# EAGLE schematic RX (EAGLE 9.2.2)

## Sheet 1 of 3: OPA354-LM7171
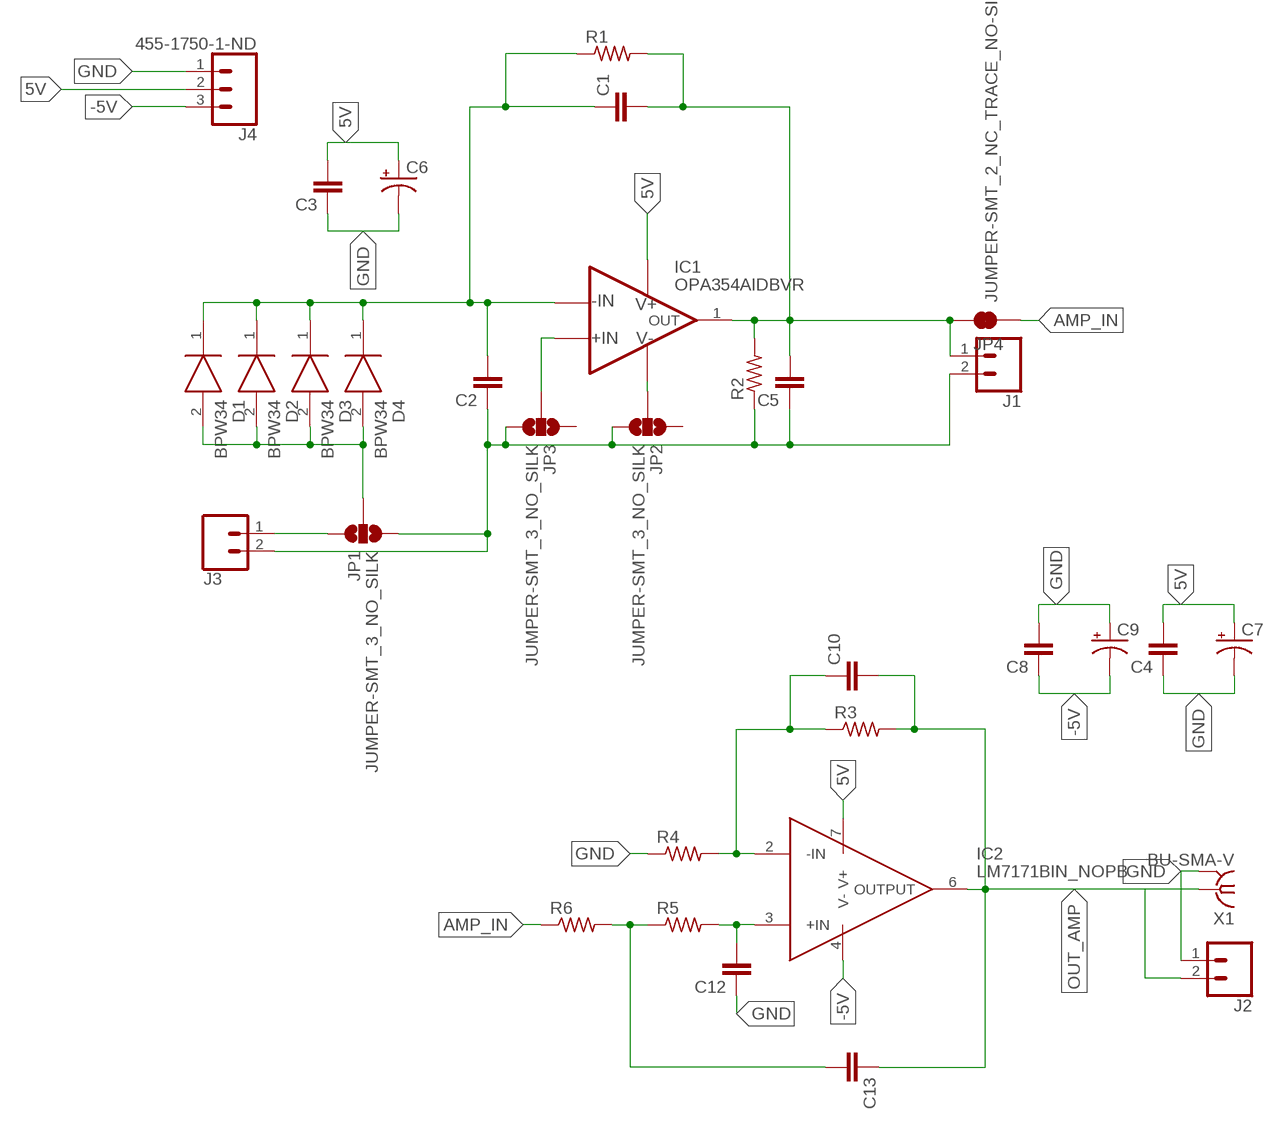
[diagram p0: schematic, sheet 1]

### Parts
C1  C-EUC0603K  [C0603K]
C2  C-EUC0603K  [C0603K]
C3  C-EUC0603K  [C0603K]
C4  C-EUC0603K  [C0603K]
C5  C-EUC0603K  [C0603K]
C6  CPOL-USR/2012-12R  [R/2012-12R]
C7  CPOL-USR/2012-12R  [R/2012-12R]
C8  C-EUC0603K  [C0603K]
C9  CPOL-USR/2012-12R  [R/2012-12R]
C10  C-EUC0603K  [C0603K]
C12  C-EUC0603K  [C0603K]
C13  C-EUC0603K  [C0603K]
D1  BPW34  [BPW34]
D2  BPW34  [BPW34]
D3  BPW34  [BPW34]
D4  BPW34  [BPW34]
IC1  OPA354AIDBVR  [SOT95P280X145-5N@1]
IC2  LM7171BIN_NOPB  [DIP794W53P254L959H508Q8N]
J1  CONN_02  [1X02]
J2  CONN_02  [1X02]
J3  CONN_02  [1X02]
J4  455-1750-1-ND  CONN_03  [1X03]
JP1  JUMPER-SMT_3_NO_SILK  [SMT-JUMPER_3_NO_SILK]
JP2  JUMPER-SMT_3_NO_SILK  [SMT-JUMPER_3_NO_SILK]
JP3  JUMPER-SMT_3_NO_SILK  [SMT-JUMPER_3_NO_SILK]
JP4  JUMPER-SMT_2_NC_TRACE_NO-SILK  [SMT-JUMPER_2_NC_TRACE_NO-SILK]
R1  R-US_R0805  [R0805]
R2  R-US_R0805  [R0805]
R3  R-US_R0805  [R0805]
R4  R-US_R0805  [R0805]
R5  R-US_R0805  [R0805]
R6  R-US_R0805  [R0805]
X1  BU-SMA-V  [BU-SMA-V]

### Nets
5V: C3.2 C4.2 C6.+ C7.+ IC1.5(V+) IC2.7(V+) J4.2
-5V: C8.1 C9.- IC2.4(V-) J4.3
-IN: C1.1 C2.2 D1.1(A) D2.1(A) D3.1(A) D4.1(A) IC1.4(-IN) R1.1
AMP_IN: JP4.1 R6.1
BIAS_PD: D1.2(C) D2.2(C) D3.2(C) D4.2(C) JP1.2
GND: C2.1 C3.1 C4.1 C5.1 C6.- C7.- C8.2 C9.+ C12.1 J1.2 J2.1 J3.2 J4.1 JP1.3 JP2.3 JP3.3 R2.1 R4.1 X1.2 X1.3 X1.4 X1.5
N$1: IC1.3(+IN) JP3.2
N$3: C1.2 C5.2 IC1.1(OUT) J1.1 JP4.2 R1.2 R2.2
N$4: J3.1 JP1.1
N$5: IC1.2(V-) JP2.2
N$6: C10.1 IC2.2(-IN) R3.1 R4.2
N$7: C12.2 IC2.3(+IN) R5.2
N$8: C13.2 R5.1 R6.2
OUT_AMP: C10.2 C13.1 IC2.6(OUTPUT) J2.2 R3.2 X1.1
Unconnected: IC2.1(N/C_1) IC2.5(N/C_2) IC2.8(N/C_3) JP2.1 JP3.1

## Sheet 2 of 3: LTC6265
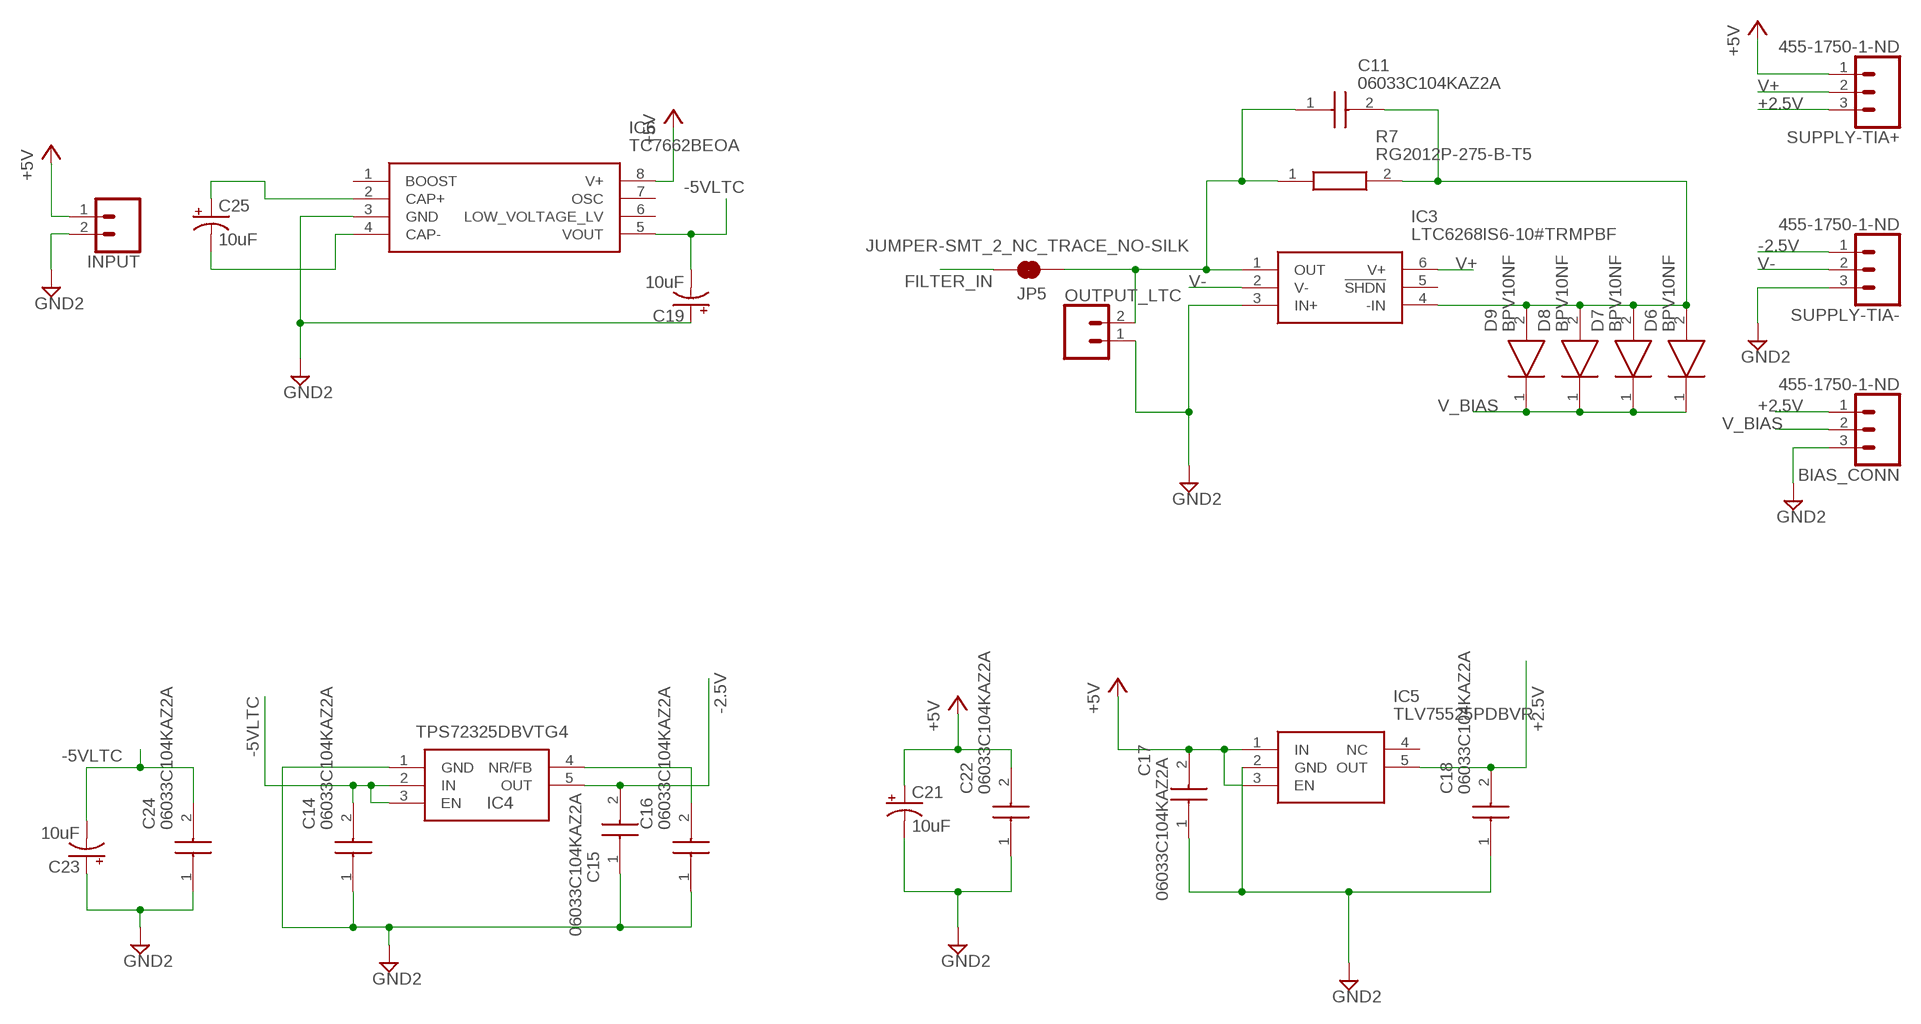
[diagram p1: schematic, sheet 2]

### Parts
BIAS_CONN  455-1750-1-ND  CONN_03  [1X03]
C11  06033C104KAZ2A  [CAPC1608X90N]
C14  06033C104KAZ2A  [CAPC1608X90N]
C15  06033C104KAZ2A  [CAPC1608X90N]
C16  06033C104KAZ2A  [CAPC1608X90N]
C17  06033C104KAZ2A  [CAPC1608X90N]
C18  06033C104KAZ2A  [CAPC1608X90N]
C19  10uF  10UF-POLAR-0603-6.3V-20%(TANT)  [0603-POLAR]
C21  10uF  10UF-POLAR-0603-6.3V-20%(TANT)  [0603-POLAR]
C22  06033C104KAZ2A  [CAPC1608X90N]
C23  10uF  10UF-POLAR-0603-6.3V-20%(TANT)  [0603-POLAR]
C24  06033C104KAZ2A  [CAPC1608X90N]
C25  10uF  10UF-POLAR-0603-6.3V-20%(TANT)  [0603-POLAR]
D6  BPV10NF  [BPV10NF]
D7  BPV10NF  [BPV10NF]
D8  BPV10NF  [BPV10NF]
D9  BPV10NF  [BPV10NF]
IC3  LTC6268IS6-10#TRMPBF  [SOT95P280X90-6N]
IC4  TPS72325DBVTG4  [SOT95P280X145-5N]
IC5  TLV75525PDBVR  [SOT95P280X145-5N]
IC6  TC7662BEOA  [SOIC127P600X175-8N]
INPUT  CONN_02  [1X02]
JP5  JUMPER-SMT_2_NC_TRACE_NO-SILK  [SMT-JUMPER_2_NC_TRACE_NO-SILK]
OUTPUT_LTC  CONN_02  [1X02]
R7  RG2012P-275-B-T5  [RESC2012X50N]
SUPPLY-TIA+  455-1750-1-ND  CONN_03  [1X03]
SUPPLY-TIA-  455-1750-1-ND  CONN_03  [1X03]

### Nets
+2.5V: BIAS_CONN.1 C18.2 IC5.5(OUT) SUPPLY-TIA+.3
+5V: C17.2 C21.+ C22.2 IC5.1(IN) IC5.3(EN) IC6.8(V+) INPUT.1 SUPPLY-TIA+.1
-2.5V: C15.2 IC4.5(OUT) SUPPLY-TIA-.1
-5VLTC: C14.2 C19.- C23.- C24.2 IC4.2(IN) IC4.3(EN) IC6.5(VOUT)
FILTER_IN: JP5.2
GND2: BIAS_CONN.3 C14.1 C15.1 C16.1 C17.1 C18.1 C19.+ C21.- C22.1 C23.+ C24.1 IC3.3(IN+) IC4.1(GND) IC5.2(GND) IC6.3(GND) INPUT.2 OUTPUT_LTC.1 SUPPLY-TIA-.3
N$9: C16.2 IC4.4(NR/FB)
N$10: C11.1 IC3.1(OUT) JP5.1 OUTPUT_LTC.2 R7.1
N$11: C25.+ IC6.2(CAP+)
N$12: C25.- IC6.4(CAP-)
N$14: C11.2 D6.2(A) D7.2(A) D8.2(A) D9.2(A) IC3.4(-IN) R7.2
V+: IC3.6(V+) SUPPLY-TIA+.2
V-: IC3.2(V-) SUPPLY-TIA-.2
V_BIAS: BIAS_CONN.2 D6.1(K) D7.1(K) D8.1(K) D9.1(K)
Unconnected: IC3.5(!SHDN) IC5.4(NC) IC6.1(BOOST) IC6.6(LOW_VOLTAGE_LV) IC6.7(OSC)

## Sheet 3 of 3
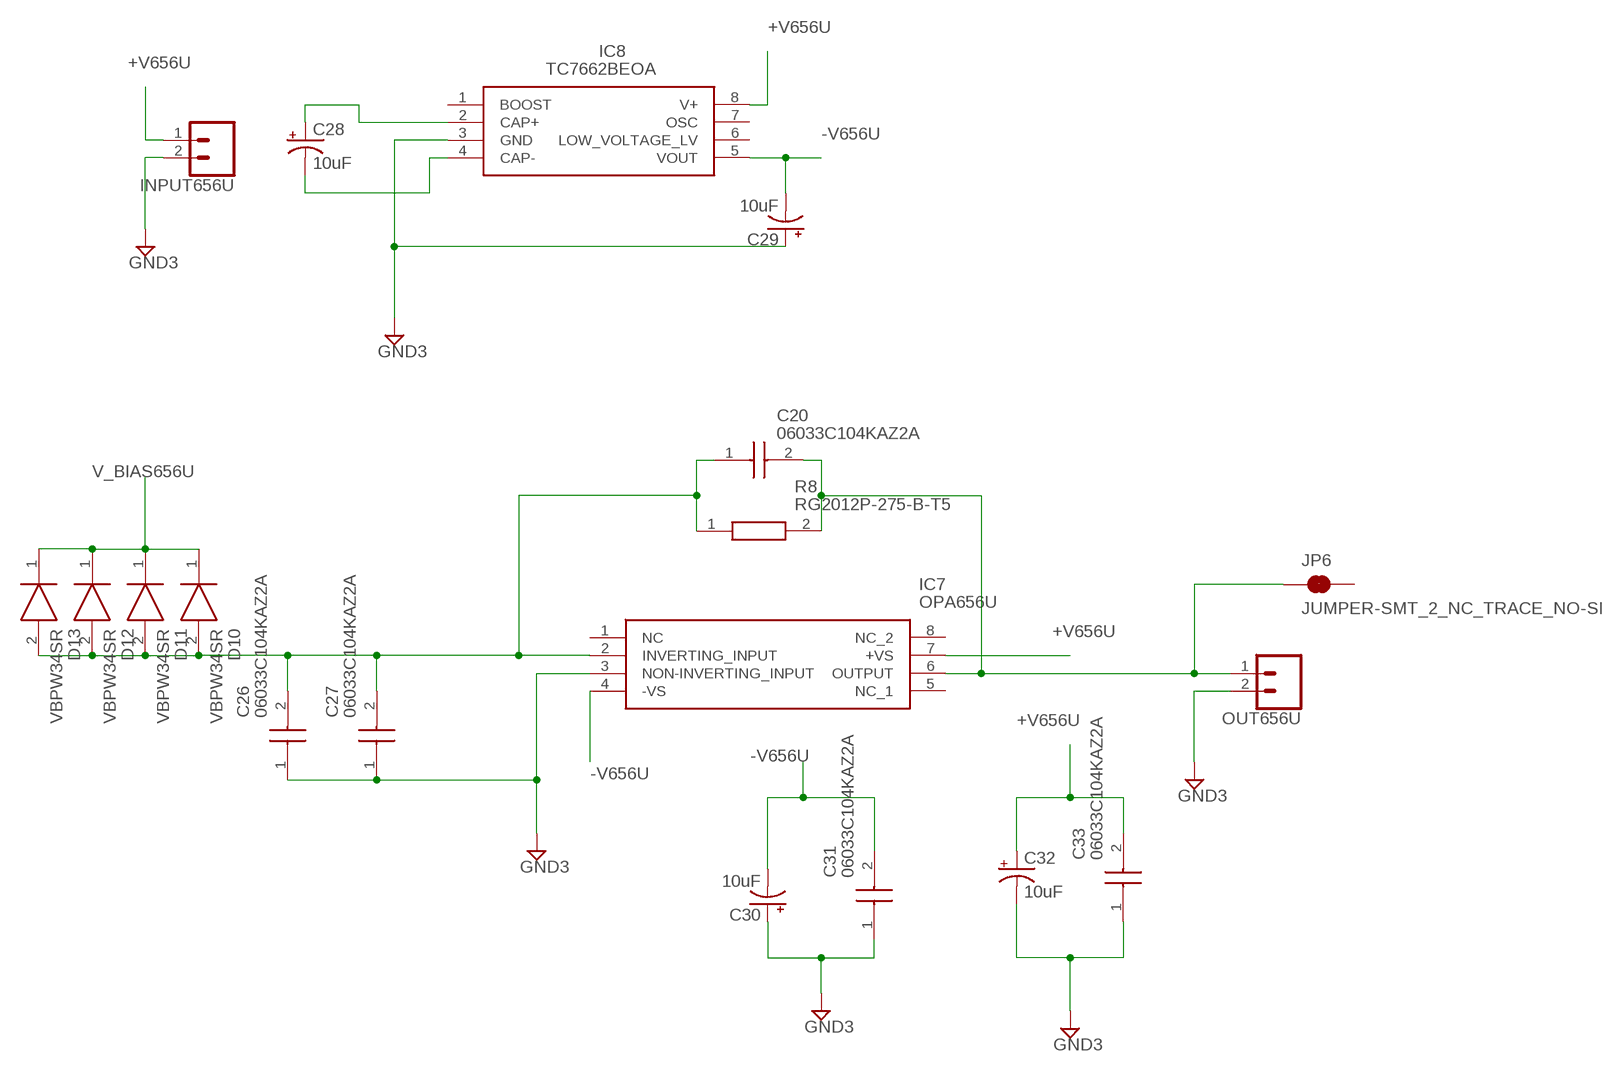
[diagram p2: schematic, sheet 3]

### Parts
C20  06033C104KAZ2A  [CAPC1608X90N]
C26  06033C104KAZ2A  [CAPC1608X90N]
C27  06033C104KAZ2A  [CAPC1608X90N]
C28  10uF  10UF-POLAR-0603-6.3V-20%(TANT)  [0603-POLAR]
C29  10uF  10UF-POLAR-0603-6.3V-20%(TANT)  [0603-POLAR]
C30  10uF  10UF-POLAR-0603-6.3V-20%(TANT)  [0603-POLAR]
C31  06033C104KAZ2A  [CAPC1608X90N]
C32  10uF  10UF-POLAR-0603-6.3V-20%(TANT)  [0603-POLAR]
C33  06033C104KAZ2A  [CAPC1608X90N]
D10  VBPW34SR  [VBPW34SR]
D11  VBPW34SR  [VBPW34SR]
D12  VBPW34SR  [VBPW34SR]
D13  VBPW34SR  [VBPW34SR]
IC7  OPA656U  [SOIC127P600X175-8N@1]
IC8  TC7662BEOA  [SOIC127P600X175-8N]
INPUT656U  CONN_02  [1X02]
JP6  JUMPER-SMT_2_NC_TRACE_NO-SILK  [SMT-JUMPER_2_NC_TRACE_NO-SILK]
OUT656U  CONN_02  [1X02]
R8  RG2012P-275-B-T5  [RESC2012X50N]

### Nets
+V656U: C32.+ C33.2 IC7.7(+VS) IC8.8(V+) INPUT656U.1
-V656U: C29.- C30.- C31.2 IC7.4(-VS) IC8.5(VOUT)
GND3: C26.1 C27.1 C29.+ C30.+ C31.1 C32.- C33.1 IC7.3(NON-INVERTING_INPUT) IC8.3(GND) INPUT656U.2 OUT656U.2
N$2: C20.1 C26.2 C27.2 D10.2(A) D11.2(A) D12.2(A) D13.2(A) IC7.2(INVERTING_INPUT) R8.1
N$13: C20.2 IC7.6(OUTPUT) JP6.1 OUT656U.1 R8.2
N$15: C28.+ IC8.2(CAP+)
N$17: C28.- IC8.4(CAP-)
V_BIAS656U: D10.1(K) D11.1(K) D12.1(K) D13.1(K)
Unconnected: IC7.1(NC) IC7.5(NC_1) IC7.8(NC_2) IC8.1(BOOST) IC8.6(LOW_VOLTAGE_LV) IC8.7(OSC) JP6.2

## Library data of the parts
BIAS_CONN J4 SUPPLY-TIA+ SUPPLY-TIA- = SparkFun-Connectors:CONN_03: Multi connection point. Often used as Generic Header-pin footprint for 0.1 inch spaced/style header connections On any of the 0.1 inch spaced packages, you can populate with these: Break Away Headers - Straight <https://www.sparkfun.com/products/116> (PRT-00116) Break Away Male Headers - Right Angle <https://www.sparkfun.com/products/553> (PRT-00553) Female Headers <https://www.sparkfun.com/products/115> (PRT-00115) Break Away Headers - Machine Pin <https://www.sparkfun.com/products/117> (PRT-00117) Break Away Female Headers - Swiss Machine Pin <https://www.sparkfun.com/products/743> (PRT-00743) Stackable Header - 3 Pin (Female, 0.1") <https://www.sparkfun.com/products/13875> (PRT-13875) For SCREWTERMINALS and SPRING TERMINALS visit here: Screw Terimnals on SparkFun.com <https://www.sparkfun.com/search/results?term=Screw+Terminals> (5mm/3.5mm/2.54mm spacing) This device is also useful as a general connection point to wire up your design to another part of your project. Our various solder wires solder well into these plated through hole pads. Hook-Up Wire - Assortment (Stranded, 22 AWG) <https://www.sparkfun.com/products/11375> (PRT-11375) Hook-Up Wire - Assortment (Solid Core, 22 AWG) <https://www.sparkfun.com/products/11367> (PRT-11367) View the entire wire category on our website here <https://www.sparkfun.com/categories/141> Special notes: Molex polarized connector foot print use with SKU : PRT-08232 with associated crimp pins and housings.; PROD_ID: XXX-00000
C1-C5 C8 C10 C12 C13 = rcl:C-EU: CAPACITOR, European symbol; SPICEPREFIX: C
C6 C7 C9 = rcl-2:CPOL-US: POLARIZED CAPACITOR, American symbol
C11 C14-C18 C20 C22 C24 C26 C27 C31 C33 = SamacSys_Parts:06033C104KAZ2A: AVX 0603 Standard 100nF Ceramic Multilayer Capacitor, 25 V dc, +125 Source: Datasheet <http://datasheets.avx.com/X7RDielectric.pdf>; DESCRIPTION: AVX 0603 Standard 100nF Ceramic Multilayer Capacitor, 25 V dc, +125; HEIGHT: 0.9mm; MANUFACTURER_NAME: AVX; MANUFACTURER_PART_NUMBER: 06033C104KAZ2A; MOUSER_PART_NUMBER: 581-06033C104KAZ2A; MOUSER_PRICE-STOCK: https://www.mouser.com/Search/Refine.aspx?Keyword=581-06033C104KAZ2A; RS_PART_NUMBER: 1356596; RS_PRICE-STOCK: https://uk.rs-online.com/web/p/products/1356596
C19 C21 C23 C25 C28-C30 C32 = SparkFun-Capacitors:10UF-POLAR: 10.0µF polarized capacitors A capacitor is a passive two-terminal electrical component used to store electrical energy temporarily in an electric field.; PROD_ID: CAP-13210
D1-D4 = SamacSys_Parts:BPW34: IR Photodiode PIN 900nm Vishay BPW34 IR + Visible Light Si Photodiode, 65 , Through-hole Source: Datasheet <http://www.farnell.com/datasheets/2046123.pdf>; ALLIED_NUMBER: 70026406; ALLIED_PRICE-STOCK: https://www.alliedelec.com/siliconix-vishay-bpw34/70026406/; DESCRIPTION: IR Photodiode PIN 900nm Vishay BPW34 IR + Visible Light Si Photodiode, 65 , Through-hole; HEIGHT: mm; MANUFACTURER_NAME: Vishay; MANUFACTURER_PART_NUMBER: BPW34; MOUSER_PART_NUMBER: 782-BPW34; MOUSER_PRICE-STOCK: https://www.mouser.com/Search/Refine.aspx?Keyword=782-BPW34; RS_PART_NUMBER: 6997616P; RS_PRICE-STOCK: http://uk.rs-online.com/web/p/products/6997616P
D6-D9 = SamacSys_Parts:BPV10NF: BPV10NF Vishay, IR Si Photodiode, 20 , Through Hole 5mm package Source: Datasheet <https://www.vishay.com/docs/81503/bpv10nf.pdf>; DESCRIPTION: BPV10NF Vishay, IR Si Photodiode, 20 , Through Hole 5mm package; HEIGHT: 8.9mm; MANUFACTURER_NAME: Vishay; MANUFACTURER_PART_NUMBER: BPV10NF; MOUSER_PART_NUMBER: 782-BPV10NF; MOUSER_PRICE-STOCK: https://www.mouser.com/Search/Refine.aspx?Keyword=782-BPV10NF; RS_PART_NUMBER: 6997607P; RS_PRICE-STOCK: http://uk.rs-online.com/web/p/products/6997607P
D10-D13 = SamacSys_Parts:VBPW34SR: Vishay VBPW34SR IR + Visible Light Si Photodiode, +/-65 , SMD Reverse Gullwing Source: Datasheet <http://www.mouser.com/ds/2/427/vbpw34s-244735.pdf>; DESCRIPTION: Vishay VBPW34SR IR + Visible Light Si Photodiode, +/-65 , SMD Reverse Gullwing; HEIGHT: mm; MANUFACTURER_NAME: Vishay; MANUFACTURER_PART_NUMBER: VBPW34SR; MOUSER_PART_NUMBER: 782-VBPW34SR; MOUSER_PRICE-STOCK: https://www.mouser.com/Search/Refine.aspx?Keyword=782-VBPW34SR; RS_PART_NUMBER: 9195813; RS_PRICE-STOCK: https://uk.rs-online.com/web/p/products/9195813
IC1 = SamacSys_Parts:OPA354AIDBVR: 250MHz, Rail-to-Rail I/O, CMOS Single Operational Amplifier Source: Datasheet <http://www.ti.com/lit/gpn/OPA354>; DESCRIPTION: 250MHz, Rail-to-Rail I/O, CMOS Single Operational Amplifier; HEIGHT: 1.45mm; MANUFACTURER_NAME: Texas Instruments; MANUFACTURER_PART_NUMBER: OPA354AIDBVR; MOUSER_PART_NUMBER: 595-OPA354AIDBVR; MOUSER_PRICE-STOCK: https://www.mouser.com/Search/Refine.aspx?Keyword=595-OPA354AIDBVR
IC2 = SamacSys_Parts:LM7171BIN_NOPB: Texas Instruments LM7171BIN/NOPB Op Amp, 125MHz, 6 28 V, 8-Pin MDIP Source: Datasheet <http://www.ti.com/lit/gpn/lm7171>; DESCRIPTION: Texas Instruments LM7171BIN/NOPB Op Amp, 125MHz, 6 28 V, 8-Pin MDIP; HEIGHT: 5.08mm; MANUFACTURER_NAME: Texas Instruments; MANUFACTURER_PART_NUMBER: LM7171BIN/NOPB; MOUSER_PART_NUMBER: 926-LM7171BIN/NOPB; MOUSER_PRICE-STOCK: https://www.mouser.com/Search/Refine.aspx?Keyword=926-LM7171BIN%2FNOPB; RS_PART_NUMBER: 5343762P; RS_PRICE-STOCK: http://uk.rs-online.com/web/p/products/5343762P
IC3 = SamacSys_Parts:LTC6268IS6-10#TRMPBF: LINEAR TECHNOLOGY - LTC6268IS6-10#TRMPBF - OP AMP, SINGLE, 4GHZ, 1.5KV/US, TSOT23-6 Source: Datasheet <http://www.linear.com/docs/46371>; DESCRIPTION: LINEAR TECHNOLOGY - LTC6268IS6-10#TRMPBF - OP AMP, SINGLE, 4GHZ, 1.5KV/US, TSOT23-6; HEIGHT: 0.9mm; MANUFACTURER_NAME: Linear Technology; MANUFACTURER_PART_NUMBER: LTC6268IS6-10#TRMPBF; MOUSER_PART_NUMBER: 584-C6268IS6-10TMPF; MOUSER_PRICE-STOCK: https://www.mouser.com/Search/Refine.aspx?Keyword=584-C6268IS6-10TMPF
IC4 = SamacSys_Parts:TPS72325DBVTG4: LDO Voltage Regulators 200mA Low Noise High-PSRR Source: Datasheet <http://www.ti.com/general/docs/suppproductinfo.tsp?distId=10&gotoUrl=http://www.ti.com/lit/gpn/tps723>; DESCRIPTION: LDO Voltage Regulators 200mA Low Noise High-PSRR; HEIGHT: 1.45mm; MANUFACTURER_NAME: Texas Instruments; MANUFACTURER_PART_NUMBER: TPS72325DBVTG4; MOUSER_PART_NUMBER: 595-TPS72325DBVTG4; MOUSER_PRICE-STOCK: https://www.mouser.com/Search/Refine.aspx?Keyword=595-TPS72325DBVTG4
IC5 = SamacSys_Parts:TLV75525PDBVR: 500-mA low-IQ small-size low-dropout (LDO) regulator Source: Datasheet <http://www.ti.com/lit/gpn/tlv755p>; DESCRIPTION: 500-mA low-IQ small-size low-dropout (LDO) regulator; HEIGHT: 1.45mm; MANUFACTURER_NAME: Texas Instruments; MANUFACTURER_PART_NUMBER: TLV75525PDBVR; MOUSER_PART_NUMBER: 595-TLV75525PDBVR; MOUSER_PRICE-STOCK: https://www.mouser.com/Search/Refine.aspx?Keyword=595-TLV75525PDBVR
IC6 IC8 = SamacSys_Parts:TC7662BEOA: DC-TO-DC VOLTAGE CONVERTER Source: Datasheet <http://componentsearchengine.com/Datasheets/3/TC7662BEOA.pdf>; ALLIED_NUMBER: 70045795; ALLIED_PRICE-STOCK: https://www.alliedelec.com/microchip-technology-inc-tc7662beoa/70045795/; DESCRIPTION: DC-TO-DC VOLTAGE CONVERTER; HEIGHT: mm; MANUFACTURER_NAME: Microchip; MANUFACTURER_PART_NUMBER: TC7662BEOA; MOUSER_PART_NUMBER: 579-TC7662BEOA; MOUSER_PRICE-STOCK: https://www.mouser.com/Search/Refine.aspx?Keyword=579-TC7662BEOA; RS_PART_NUMBER: 2509532389; RS_PRICE-STOCK: http://uk.rs-online.com/web/p/products/2509532389
IC7 = SamacSys_Parts:OPA656U: OPA656UG4, Operational Amplifier Voltage Feedback, 230MHz, 8-Pin SOIC Source: Datasheet <http://www.ti.com/lit/ds/symlink/opa656.pdf>; DESCRIPTION: OPA656UG4, Operational Amplifier Voltage Feedback, 230MHz, 8-Pin SOIC; HEIGHT: 1.75mm; MANUFACTURER_NAME: Texas Instruments; MANUFACTURER_PART_NUMBER: OPA656U; MOUSER_PART_NUMBER: 595-OPA656U; MOUSER_PRICE-STOCK: https://www.mouser.com/Search/Refine.aspx?Keyword=595-OPA656U; RS_PART_NUMBER: 6604368P; RS_PRICE-STOCK: http://uk.rs-online.com/web/p/products/6604368P
INPUT INPUT656U J1-J3 OUT656U OUTPUT_LTC = SparkFun-Connectors:CONN_02: Multi connection point. Often used as Generic Header-pin footprint for 0.1 inch spaced/style header connections On any of the 0.1 inch spaced packages, you can populate with these: Break Away Headers - Straight <https://www.sparkfun.com/products/116> (PRT-00116) Break Away Male Headers - Right Angle <https://www.sparkfun.com/products/553> (PRT-00553) Female Headers <https://www.sparkfun.com/products/115> (PRT-00115) Break Away Headers - Machine Pin <https://www.sparkfun.com/products/117> (PRT-00117) Break Away Female Headers - Swiss Machine Pin <https://www.sparkfun.com/products/743> (PRT-00743) For SCREWTERMINALS and SPRING TERMINALS visit here: Screw Terimnals on SparkFun.com <https://www.sparkfun.com/search/results?term=Screw+Terminals> (5mm/3.5mm/2.54mm spacing) This device is also useful as a general connection point to wire up your design to another part of your project. Our various solder wires solder well into these plated through hole pads. Hook-Up Wire - Assortment (Stranded, 22 AWG) <https://www.sparkfun.com/products/11375> (PRT-11375) Hook-Up Wire - Assortment (Solid Core, 22 AWG) <https://www.sparkfun.com/products/11367> (PRT-11367) View the entire wire category on our website here <https://www.sparkfun.com/categories/141> Special notes: Molex polarized connector foot print use with: PRT-08233 with associated crimp pins and housings. 2.54_SCREWTERM for use with PRT-10571. 3.5mm Screw Terminal footprints for PRT-08084 5mm Screw Terminal footprints for use with PRT-08432
JP1-JP3 = SparkFun-Jumpers:JUMPER-SMT_3_NO: Normally open jumper This jumper has three pads in close proximity to each other. Apply solder to close the connection(s).
JP4-JP6 = SparkFun-Jumpers:JUMPER-SMT_2_NC_TRACE: Normally closed trace jumper This jumper has a trace between two pads so it's normally closed (NC). Use a razor knife to open the connection. For best results follow the IPC guidelines for cutting traces: Cutout at least 0.063 mm (0.005 in). Remove all loose material to clean up the cut area. Seal the cut with an approved epoxy. Reapply solder to reclose the connection.
R1 R2 = rcl:R-US_: RESISTOR, American symbol; SPICEPREFIX: R
R3-R6 = adafruit:R-US_: RESISTOR, American symbol
R7 R8 = SamacSys_Parts:RG2012P-275-B-T5: Thin Film Resistors - SMD 1/4W 2.7M OHM .1% AEC Q200 Qualified Source: Datasheet <https://media.digikey.com/pdf/Data Sheets/Susumu PDFs/RG_RM_RGH_Oct2012.pdf>; DESCRIPTION: Thin Film Resistors - SMD 1/4W 2.7M OHM .1% AEC Q200 Qualified; HEIGHT: 0.5mm; MANUFACTURER_NAME: Susumu; MANUFACTURER_PART_NUMBER: RG2012P-275-B-T5; MOUSER_PART_NUMBER: 754-RG2012P-275B-T5; MOUSER_PRICE-STOCK: https://www.mouser.com/Search/Refine.aspx?Keyword=754-RG2012P-275B-T5
X1 = con-coax:BU-SMA-V: FEMALE SMA CONNECTOR Radiall distributor RS 112-3794; OC_FARNELL: unknown; OC_NEWARK: unknown